# Altium schematic sheet self.SchDoc
size A4
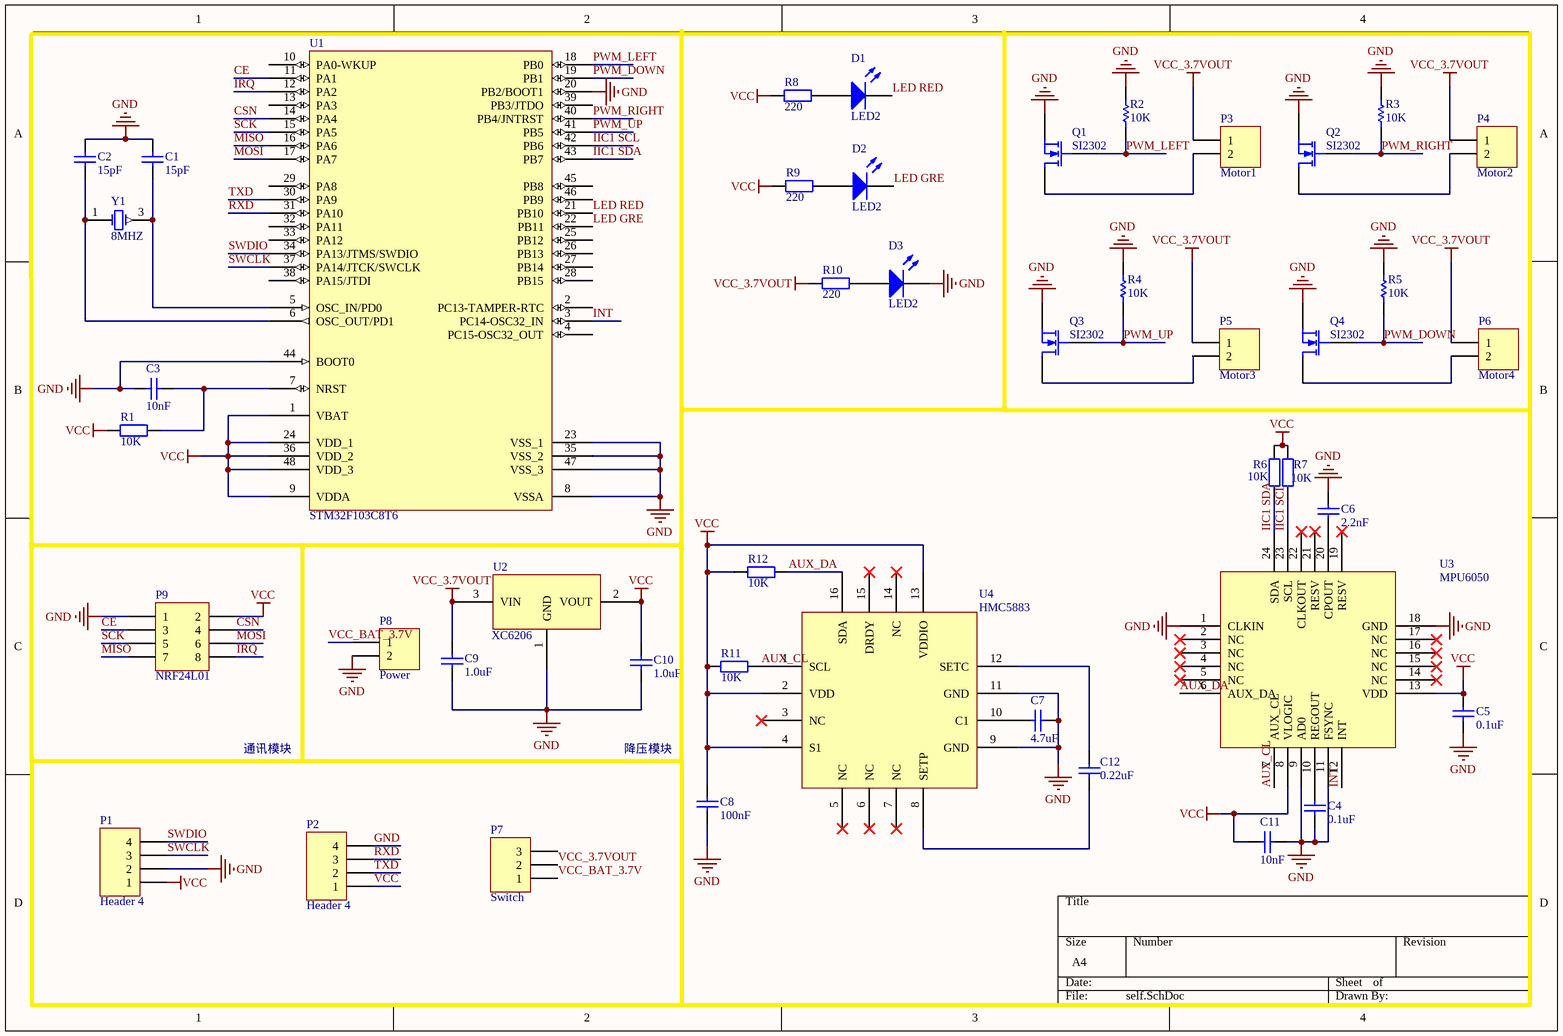
[diagram p0: self.SchDoc]

## Parts
C1  value 15pF  [0603-N-CAP]  (hidden comment: Cap Semi)
C2  value 15pF  [0603-N-CAP]  (hidden comment: Cap Semi)
C3  value 10nF  [0603-N-CAP]  (hidden comment: Cap Semi)
C4  value 0.1uF  [0603-N-CAP]  (hidden comment: Cap Semi)
C5  value 0.1uF  [0603-N-CAP]  (hidden comment: Cap Semi)
C6  value 2.2nF  [0603-N-CAP]  (hidden comment: Cap Semi)
C7  value 4.7uF  [0603-N-CAP]  (hidden comment: Cap Semi)
C8  value 100nF  [0603-N-CAP]  (hidden comment: Cap Semi)
C9  value 1.0uF  [0603-N-CAP]  (hidden comment: Cap Semi)
C10  value 1.0uF  [0603-N-CAP]  (hidden comment: Cap Semi)
C11  value 10nF  [0603-N-CAP]  (hidden comment: Cap Semi)
C12  value 0.22uF  [0603-N-CAP]  (hidden comment: Cap Semi)
D1  LED2  [6-0805_N]
D2  LED2  [6-0805_N]
D3  LED2  [6-0805_N]
P1  Header 4  [SW_download]
P2  Header 4  [HDR1X4]
P3  Motor1  [Motor]
P4  Motor2  [Motor]
P5  Motor3  [Motor]
P6  Motor4  [Motor]
P7  Switch  [SWITCH]
P8  Power  [0805]
P9  NRF24L01  [HDR2X4]
Q1  SI2302  [SOT-23]
Q2  SI2302  [SOT-23]
Q3  SI2302  [SOT-23]
Q4  SI2302  [SOT-23]
R1  value 10K  [0603-N-res]  (hidden comment: Res2)
R2  value 10K  [0603-N-res]  (hidden comment: Res1)
R3  value 10K  [0603-N-res]  (hidden comment: Res1)
R4  value 10K  [0603-N-res]  (hidden comment: Res1)
R5  value 10K  [0603-N-res]  (hidden comment: Res1)
R6  value 10K  [0603-N-res]  (hidden comment: Res2)
R7  value 10K  [0603-N-res]  (hidden comment: Res2)
R8  value 220  [0603-N-res]  (hidden comment: Res2)
R9  value 220  [0603-N-res]  (hidden comment: Res2)
R10  value 220  [0603-N-res]  (hidden comment: Res2)
R11  value 10K  [0603-N-res]  (hidden comment: Res2)
R12  value 10K  [0603-N-res]  (hidden comment: Res2)
U1  STM32F103C8T6  [LQFP48_N]
U2  XC6206  [SOT-23]
U3  MPU6050
U4  HMC5883  [HMC5883L]
Y1  8MHZ  [5032]

## Nets
GND: C1.1 C2.2 C3.1 C4.1 C5.1 C6.2 C7.1 C8.1 C9.1 C10.1 C11.2 D3.2(K) P1.2 P2.4 P8.2 P9.1 Q1.2(S) Q2.2(S) Q3.2(S) Q4.2(S) R2.2 R3.2 R4.2 R5.2 U1.8(VSSA) U1.20(PB2/BOOT1) U1.23(VSS_1) U1.35(VSS_2) U1.44(BOOT0) U1.47(VSS_3) U2.1(GND) U3.1(CLKIN) U3.9(AD0) U3.11(FSYNC) U3.18(GND) U4.9(GND) U4.11(GND)
VCC: C5.2 C8.2 C10.2 C11.1 P1.1 P2.1 P9.2 R1.2 R6.2 R7.2 R8.2 R9.2 R11.2 R12.2 U1.1(VBAT) U1.9(VDDA) U1.24(VDD_1) U1.36(VDD_2) U1.48(VDD_3) U2.2(VOUT) U3.8(VLOGIC) U3.13(VDD) U4.2(VDD) U4.4(S1) U4.13(VDDIO)
VCC_3.7VOUT: C9.2 P3.1 P4.1 P5.1 P6.1 P7.2 R10.2 U2.3(VIN)
AUX_CL: R11.1 U3.7(AUX_CL) U4.1(SCL)
AUX_DA: R12.1 U3.6(AUX_DA) U4.16(SDA)
CE: P9.3 U1.11(PA1)
CSN: P9.4 U1.14(PA4)
IIC1 SCL: R7.1 U1.42(PB6) U3.23(SCL)
IIC1 SDA: R6.1 U1.43(PB7) U3.24(SDA)
INT: U1.3(PC14-OSC32_IN) U3.12(INT)
IRQ: P9.8 U1.12(PA2)
LED GRE: D2.2(K) U1.22(PB11)
LED RED: D1.2(K) U1.21(PB10)
MISO: P9.7 U1.16(PA6)
MOSI: P9.6 U1.17(PA7)
PWM_DOWN: Q4.1(G) R5.1 U1.19(PB1)
PWM_LEFT: Q1.1(G) R2.1 U1.18(PB0)
PWM_RIGHT: Q2.1(G) R3.1 U1.40(PB4/JNTRST)
PWM_UP: Q3.1(G) R4.1 U1.41(PB5)
RXD: P2.3 U1.31(PA10)
SCK: P9.5 U1.15(PA5)
SWCLK: P1.3 U1.37(PA14/JTCK/SWCLK)
SWDIO: P1.4 U1.34(PA13/JTMS/SWDIO)
TXD: P2.2 U1.30(PA9)
VCC_BAT_3.7V: P7.1 P8.1
NetC1_2: C1.2 U1.5(OSC_IN/PD0) Y1.3(OSC2)
NetC2_1: C2.1 U1.6(OSC_OUT/PD1) Y1.1(OSC1)
NetC3_2: C3.2 R1.1 U1.7(NRST)
NetC4_2: C4.2 U3.10(REGOUT)
NetC6_1: C6.1 U3.20(CPOUT)
NetC7_2: C7.2 U4.10(C1)
NetC12_1: C12.1 U4.12(SETC)
NetC12_2: C12.2 U4.8(SETP)
NetD1_1: D1.1(A) R8.1
NetD2_1: D2.1(A) R9.1
NetD3_1: D3.1(A) R10.1
NetP3_2: P3.2 Q1.3(D)
NetP4_2: P4.2 Q2.3(D)
NetP5_2: P5.2 Q3.3(D)
NetP6_2: P6.2 Q4.3(D)

Not connected (* = marked no-connect by the designer): P7 3; U1 2(PC13-TAMPER-RTC) 4(PC15-OSC32_OUT) 10(PA0-WKUP) 13(PA3) 25(PB12) 26(PB13) 27(PB14) 28(PB15) 29(PA8) 32(PA11) 33(PA12) 38(PA15/JTDI) 39(PB3/JTDO) 45(PB8) 46(PB9); U3 2(NC)* 3(NC)* 4(NC)* 5(NC)* 14(NC)* 15(NC)* 16(NC)* 17(NC)* 19(RESV)* 21(RESV)* 22(CLKOUT)*; U4 3(NC)* 5(NC)* 6(NC)* 7(NC)* 14(NC)* 15(DRDY)*

## Notes on the sheet
- 通讯模块
- 降压模块

## Library data of the parts
C1-C12 = Cap Semi: Capacitor (Semiconductor SIM Model); Published: 8-Jun-2000; LatestRevisionDate: 29-May-2009; LatestRevisionNote: IPC-7351 Footprint Added.; PackageReference: C1206; Publisher: Altium Limited; PackageDescription: Chip Capacitor
D1-D3 = LED2: Typical RED, GREEN, YELLOW, AMBER GaAs LED; Published: 8-Jun-2000; LatestRevisionDate: 17-Jul-2002; LatestRevisionNote: Re-released for DXP Platform.; PackageVersion: Feb-2002; PackageReference: 3.2X1.6X1.1; Publisher: Altium Limited; PackageDescription: SM LED; 2 Flat Leads
P1 P2 = Header 4: Header, 4-Pin; LatestRevisionDate: 17-Jul-2002; LatestRevisionNote: Re-released for DXP Platform.; Publisher: Altium Limited
P3-P6 P8 = Header 2: Header, 2-Pin; LatestRevisionDate: 17-Jul-2002; LatestRevisionNote: Re-released for DXP Platform.; Publisher: Altium Limited
P7 = Header 3: Header, 3-Pin; LatestRevisionDate: 17-Jul-2002; LatestRevisionNote: Re-released for DXP Platform.; Publisher: Altium Limited
P9 = Header 4X2H: Header, 4-Pin, Dual row, Right Angle; LatestRevisionDate: 17-Jul-2002; LatestRevisionNote: Re-released for DXP Platform.; Publisher: Altium Limited
Q1-Q4 = MOSFET-N: N-Channel MOSFET; Published: 8-Jun-2000; LatestRevisionDate: 17-Jul-2002; LatestRevisionNote: Re-released for DXP Platform.; PackageVersion: 1995/1996; PackageReference: E3; Publisher: Altium Limited; PackageDescription: TO, Flat Index; 3 In-Line, Axial Leads; Body Dia. 4.6mm; Lead Dia. 0.5 mm (max)
R1 R6-R12 = Res2: Resistor; Published: 8-Jun-2000; LatestRevisionDate: 17-Jul-2002; LatestRevisionNote: Re-released for DXP Platform.; PackageReference: AXIAL-0.4; Publisher: Altium Limited; PackageDescription: Axial Device, Thru-Hole; 2 Leads; 0.4 in Pin Spacing
R2-R5 = Res1: Resistor; Published: 8-Jun-2000; LatestRevisionDate: 17-Jul-2002; LatestRevisionNote: Re-released for DXP Platform.; PackageReference: AXIAL-0.3; Publisher: Altium Limited; PackageDescription: Axial Device, Thru-Hole; 2 Leads; 0.3 in Pin Spacing
U1 = STM32F103C8T6: STM32 ARM-based 32-bit MCU with 64 Kbytes Flash, 48-pin LQFP, Industrial Temperature; Published: 30-May-2008; DatasheetVersion: rev6, Mar-2008; PackageVersion: Mar-2008; PackageReference: LQFP48; Publisher: Altium Limited; PackageDescription: 48-Pin Low-Profile Quad Flat Pack, 7 x 7 mm Body, 0.5 mm Pitch (LQFP48); ComponentLink1Description: Manufacturer Link; ComponentLink1URL: www.st.com/stm32; ComponentLink2Description: Datasheet; ComponentLink2URL: http://www.st.com/stonline/products/literature/ds/13587.pdf
Y1 = XTAL: Crystal Oscillator; Published: 8-Jun-2000; LatestRevisionDate: 17-Jul-2002; LatestRevisionNote: Re-released for DXP Platform.; PackageReference: R38; Publisher: Altium Limited; PackageDescription: Crystal, Thru-Hole; 2 Leads; Body 3.1 x 8.2 mm (Dia.xH)